# Altium schematic sheet 主控制芯片.SchDoc
size A3
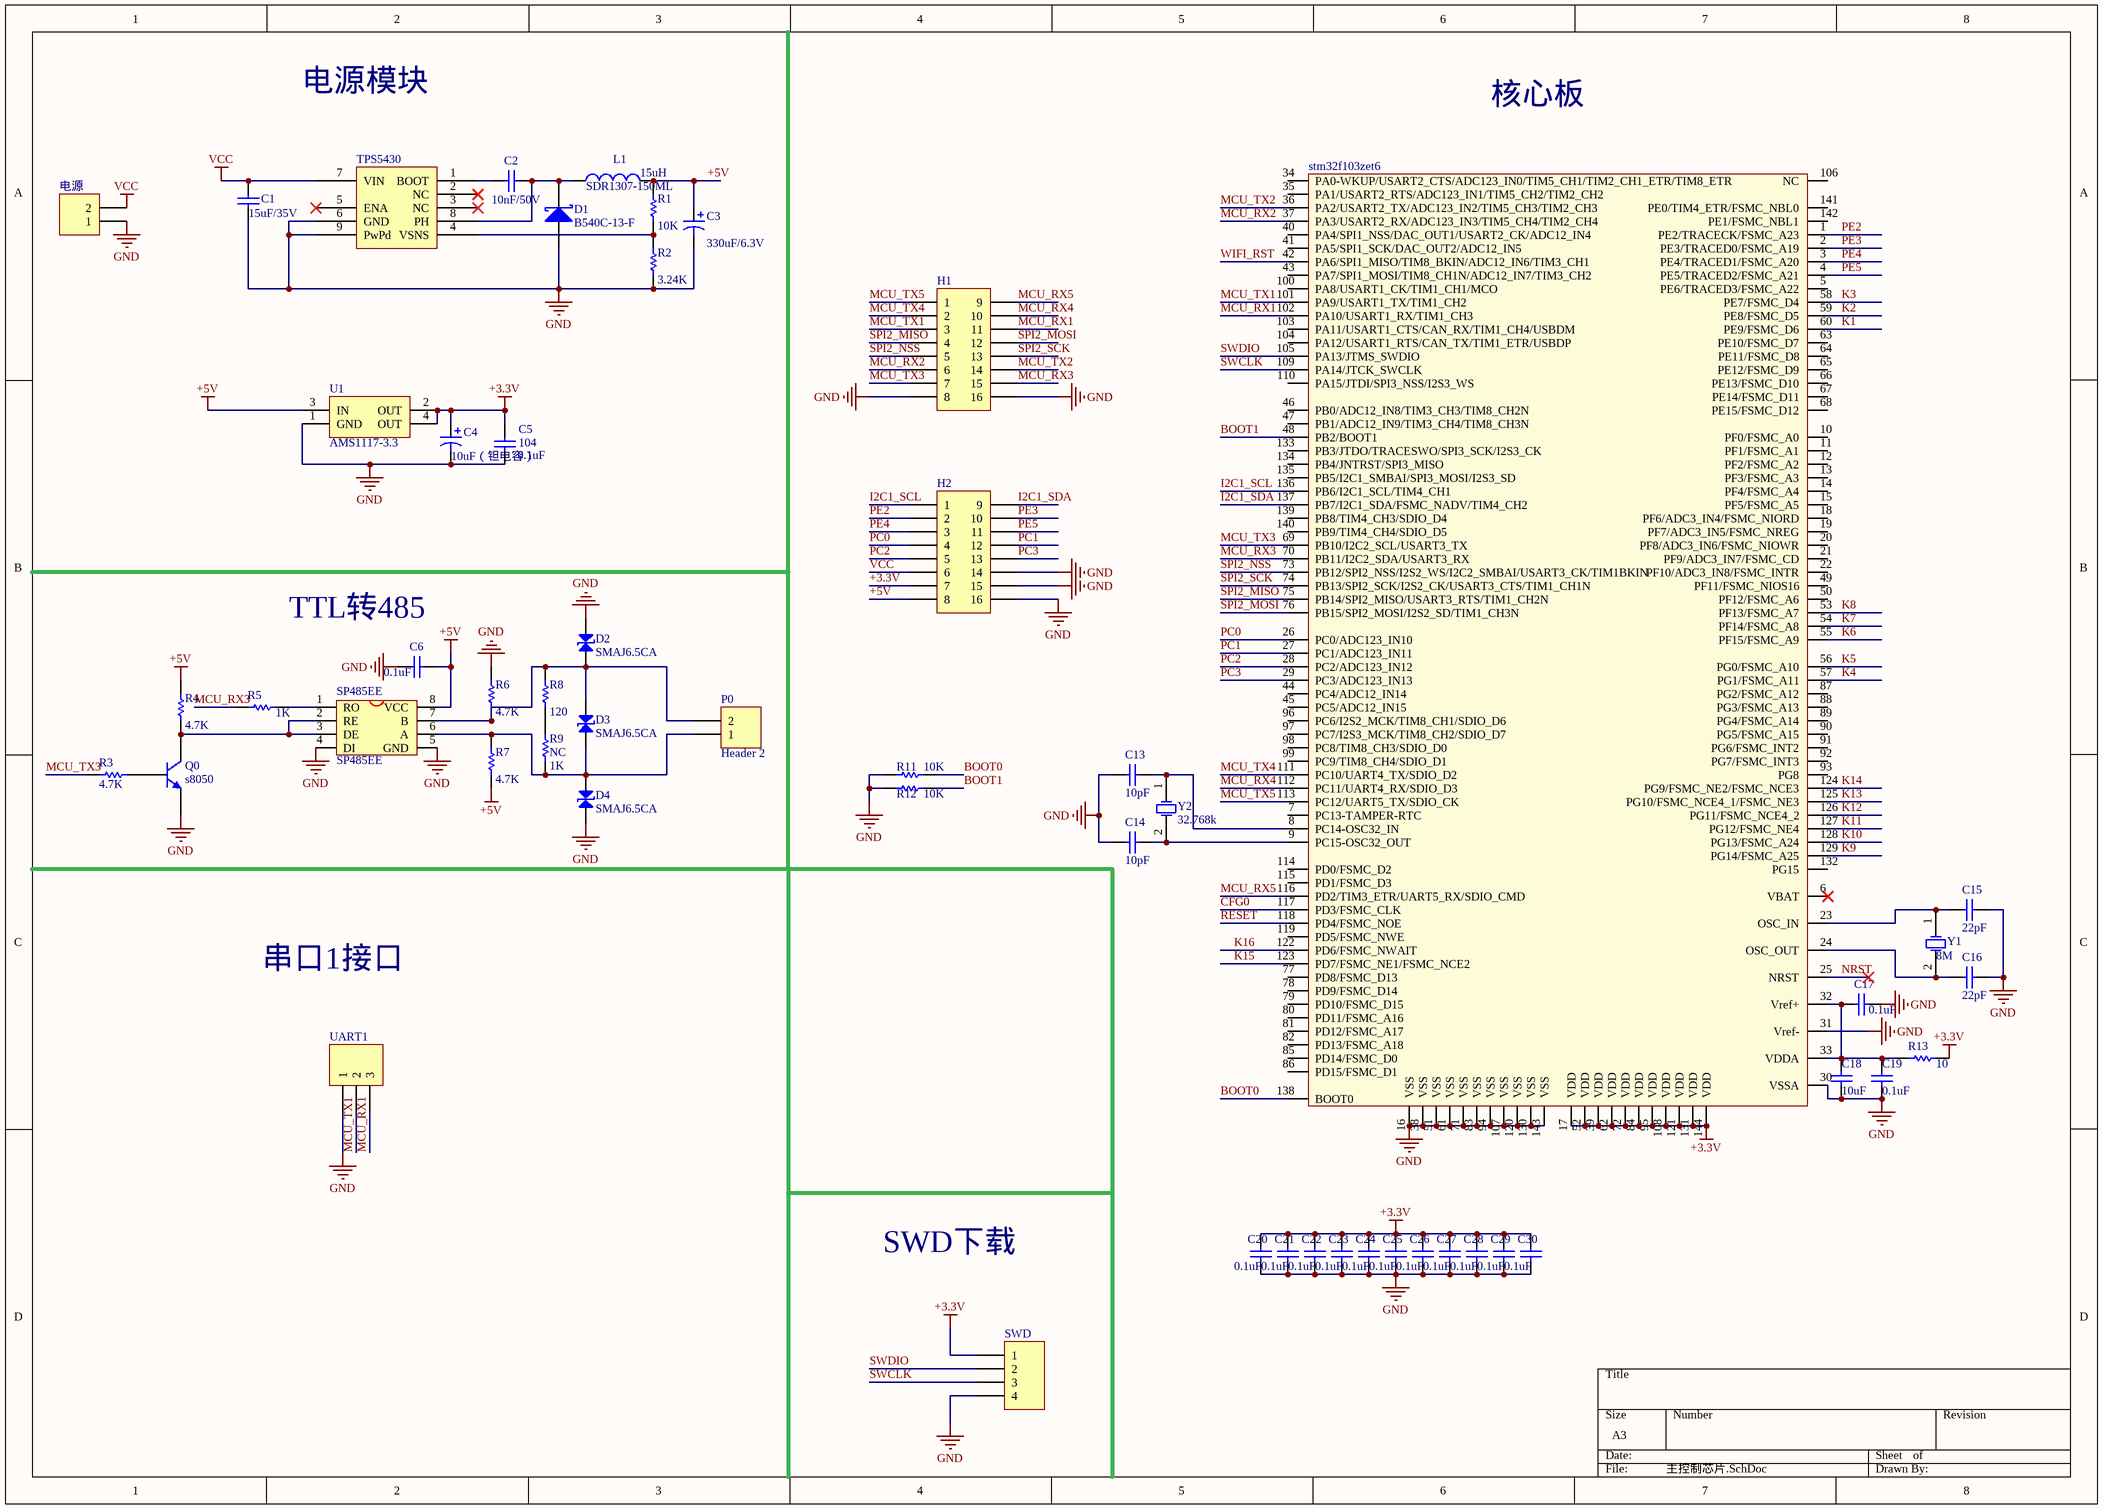
[diagram p0: 主控制芯片.SchDoc]

## Parts
C1  value 15uF/35V  [1206]  (hidden comment: C2012X5R1V156M125AC)
C2  value 10nF/50V  [0603]  (hidden comment: C0805C103K5RACTU)
C3  value 330uF/6.3V  [钽电容(D)]  (hidden comment: 6TPC330MA)
C4  10uF（钽电容）  [钽电容(B)]
C5  104  value 0.1uF  [0603]
C6  value 0.1uF  [0603]  (hidden comment: 104)
C13  value 10pF  [0603]  (hidden comment: 10)
C14  value 10pF  [0603]  (hidden comment: 10)
C15  value 22pF  [0603]  (hidden comment: 22)
C16  value 22pF  [0603]  (hidden comment: 22)
C17  value 0.1uF  [0603]  (hidden comment: 104)
C18  value 10uF  [0603]  (hidden comment: 106)
C19  value 0.1uF  [0603]  (hidden comment: 104)
C20  value 0.1uF  [0603]  (hidden comment: 104)
C21  value 0.1uF  [0603]  (hidden comment: 104)
C22  value 0.1uF  [0603]  (hidden comment: 104)
C23  value 0.1uF  [0603]  (hidden comment: 104)
C24  value 0.1uF  [0603]  (hidden comment: 104)
C25  value 0.1uF  [0603]  (hidden comment: 104)
C26  value 0.1uF  [0603]  (hidden comment: 104)
C27  value 0.1uF  [0603]  (hidden comment: 104)
C28  value 0.1uF  [0603]  (hidden comment: 104)
C29  value 0.1uF  [0603]  (hidden comment: 104)
C30  value 0.1uF  [0603]  (hidden comment: 104)
D1  B540C-13-F  [SMC]
D2  SMAJ6.5CA  [SMA]
D3  SMAJ6.5CA  [SMA]
D4  SMAJ6.5CA  [SMA]
H1  Header 8X2A  [HDR2X8_CEN]  (value not drawn)
H2  Header 8X2A  [HDR2X8_CEN]  (value not drawn)
L1  SDR1307-150ML  value 15uH  [CDRH127]
P0  Header 2  [电源]
Q0  s8050  [SOT-23]
R1  10K  [0603]
R2  3.24K  [0603]
R3  4.7k  [0603]
R4  4.7k  [0603]
R5  1K  [0603]
R6  4.7k  [0603]
R7  4.7k  [0603]
R8  120  [0603]
R9  NC  value 1K  [0603]
R11  10K  [0603]
R12  10K  [0603]
R13  10  [0603]
SP485EE  SP485EE  [SOP-8]
stm32f103zet6  stm32f103zet6  [LQFP144]  (value not drawn)
SWD  Header 4  [SWD]  (value not drawn)
TPS5430  TPS5430DDAR  [TPS5430]  (value not drawn)
U1  AMS1117-3.3  [1117-3.3]
UART1  Header 3  [H3]  (value not drawn)
Y1  8M  [5032(8M)]
Y2  32.768k  [FC135(32.768K)]
电源  DUANZI  [电源]  (value not drawn)

## Nets
+3.3V: C4.1 C5.2 C20.1 C21.1 C22.1 C23.1 C24.1 C25.1 C26.1 C27.1 C28.1 C29.1 C30.1 H2.7 R13.2 stm32f103zet6.17(VDD) stm32f103zet6.39(VDD) stm32f103zet6.52(VDD) stm32f103zet6.62(VDD) stm32f103zet6.72(VDD) stm32f103zet6.84(VDD) stm32f103zet6.95(VDD) stm32f103zet6.108(VDD) stm32f103zet6.121(VDD) stm32f103zet6.131(VDD) stm32f103zet6.144(VDD) SWD.1 U1.2(OUT) U1.4(OUT)
+5V: C3.1 C6.2 H2.8 L1.2 R1.2 R4.1 R7.2 SP485EE.8(VCC) U1.3(IN)
GND: C1.2 C3.2 C4.2 C5.1 C6.1 C13.2 C14.2 C15.1 C16.1 C17.1 C18.2 C19.2 C20.2 C21.2 C22.2 C23.2 C24.2 C25.2 C26.2 C27.2 C28.2 C29.2 C30.2 D1.1(A) D2.2 D4.1 H1.8 H1.16 H2.14 H2.15 H2.16 Q0.3(E) R2.1 R6.1 R11.2 R12.2 SP485EE.4(DI) SP485EE.5(GND) stm32f103zet6.16(VSS) stm32f103zet6.30(VSSA) stm32f103zet6.31(Vref-) stm32f103zet6.38(VSS) stm32f103zet6.51(VSS) stm32f103zet6.61(VSS) stm32f103zet6.71(VSS) stm32f103zet6.83(VSS) stm32f103zet6.94(VSS) stm32f103zet6.107(VSS) stm32f103zet6.120(VSS) stm32f103zet6.130(VSS) stm32f103zet6.143(VSS) SWD.4 TPS5430.6(GND) TPS5430.9(PwPd) U1.1(GND) UART1.1 电源.1
VCC: C1.1 H2.6 TPS5430.7(VIN) 电源.2
BOOT0: R11.1 stm32f103zet6.138(BOOT0)
BOOT1: R12.1 stm32f103zet6.48(PB2/BOOT1)
CFG0: stm32f103zet6.117(PD3/FSMC_CLK)
I2C1_SCL: H2.1 stm32f103zet6.136(PB6/I2C1_SCL/TIM4_CH1)
I2C1_SDA: H2.9 stm32f103zet6.137(PB7/I2C1_SDA/FSMC_NADV/TIM4_CH2)
K1: stm32f103zet6.60(PE9/FSMC_D6)
K2: stm32f103zet6.59(PE8/FSMC_D5)
K3: stm32f103zet6.58(PE7/FSMC_D4)
K4: stm32f103zet6.57(PG1/FSMC_A11)
K5: stm32f103zet6.56(PG0/FSMC_A10)
K6: stm32f103zet6.55(PF15/FSMC_A9)
K7: stm32f103zet6.54(PF14/FSMC_A8)
K8: stm32f103zet6.53(PF13/FSMC_A7)
K9: stm32f103zet6.129(PG14/FSMC_A25)
K10: stm32f103zet6.128(PG13/FSMC_A24)
K11: stm32f103zet6.127(PG12/FSMC_NE4)
K12: stm32f103zet6.126(PG11/FSMC_NCE4_2)
K13: stm32f103zet6.125(PG10/FSMC_NCE4_1/FSMC_NE3)
K14: stm32f103zet6.124(PG9/FSMC_NE2/FSMC_NCE3)
K15: stm32f103zet6.123(PD7/FSMC_NE1/FSMC_NCE2)
K16: stm32f103zet6.122(PD6/FSMC_NWAIT)
MCU_RX1: H1.11 stm32f103zet6.102(PA10/USART1_RX/TIM1_CH3) UART1.3
MCU_RX2: H1.6 stm32f103zet6.37(PA3/USART2_RX/ADC123_IN3/TIM5_CH4/TIM2_CH4)
MCU_RX3: H1.15 R5.1 stm32f103zet6.70(PB11/I2C2_SDA/USART3_RX)
MCU_RX4: H1.10 stm32f103zet6.112(PC11/UART4_RX/SDIO_D3)
MCU_RX5: H1.9 stm32f103zet6.116(PD2/TIM3_ETR/UART5_RX/SDIO_CMD)
MCU_TX1: H1.3 stm32f103zet6.101(PA9/USART1_TX/TIM1_CH2) UART1.2
MCU_TX2: H1.14 stm32f103zet6.36(PA2/USART2_TX/ADC123_IN2/TIM5_CH3/TIM2_CH3)
MCU_TX3: H1.7 R3.1 stm32f103zet6.69(PB10/I2C2_SCL/USART3_TX)
MCU_TX4: H1.2 stm32f103zet6.111(PC10/UART4_TX/SDIO_D2)
MCU_TX5: H1.1 stm32f103zet6.113(PC12/UART5_TX/SDIO_CK)
NRST: stm32f103zet6.25(NRST)
PC0: H2.4 stm32f103zet6.26(PC0/ADC123_IN10)
PC1: H2.12 stm32f103zet6.27(PC1/ADC123_IN11)
PC2: H2.5 stm32f103zet6.28(PC2/ADC123_IN12)
PC3: H2.13 stm32f103zet6.29(PC3/ADC123_IN13)
PE2: H2.2 stm32f103zet6.1(PE2/TRACECK/FSMC_A23)
PE3: H2.10 stm32f103zet6.2(PE3/TRACED0/FSMC_A19)
PE4: H2.3 stm32f103zet6.3(PE4/TRACED1/FSMC_A20)
PE5: H2.11 stm32f103zet6.4(PE5/TRACED2/FSMC_A21)
RESET: stm32f103zet6.118(PD4/FSMC_NOE)
SPI2_MISO: H1.4 stm32f103zet6.75(PB14/SPI2_MISO/USART3_RTS/TIM1_CH2N)
SPI2_MOSI: H1.12 stm32f103zet6.76(PB15/SPI2_MOSI/I2S2_SD/TIM1_CH3N)
SPI2_NSS: H1.5 stm32f103zet6.73(PB12/SPI2_NSS/I2S2_WS/I2C2_SMBAI/USART3_CK/TIM1BKIN)
SPI2_SCK: H1.13 stm32f103zet6.74(PB13/SPI2_SCK/I2S2_CK/USART3_CTS/TIM1_CH1N)
SWCLK: stm32f103zet6.109(PA14/JTCK_SWCLK) SWD.3
SWDIO: stm32f103zet6.105(PA13/JTMS_SWDIO) SWD.2
WIFI_RST: stm32f103zet6.42(PA6/SPI1_MISO/TIM8_BKIN/ADC12_IN6/TIM3_CH1)
NetC2_1: C2.1 TPS5430.1(BOOT)
NetC2_2: C2.2 D1.2(K) L1.1 TPS5430.8(PH)
NetC13_1: C13.1 stm32f103zet6.8(PC14-OSC32_IN) Y2.1(OSC1)
NetC14_1: C14.1 stm32f103zet6.9(PC15-OSC32_OUT) Y2.2(OSC2)
NetC15_2: C15.2 stm32f103zet6.23(OSC_IN) Y1.1(OSC1)
NetC16_2: C16.2 stm32f103zet6.24(OSC_OUT) Y1.2(OSC2)
NetC17_2: C17.2 C18.1 C19.1 R13.1 stm32f103zet6.32(Vref+) stm32f103zet6.33(VDDA)
NetD2_1: D2.1 D3.2 P0.2 R6.2 R8.2 SP485EE.7(B)
NetD3_1: D3.1 D4.2 P0.1 R7.1 R9.1 SP485EE.6(A)
NetQ0_1: Q0.1(C) R4.2 SP485EE.2(RE) SP485EE.3(DE)
NetQ0_2: Q0.2(B) R3.2
NetR1_1: R1.1 R2.2 TPS5430.4(VSNS)
NetR5_2: R5.2 SP485EE.1(RO)
NetR8_1: R8.1 R9.2

Not connected (* = marked no-connect by the designer): stm32f103zet6 5(PE6/TRACED3/FSMC_A22) 6(VBAT)* 7(PC13-TAMPER-RTC) 10(PF0/FSMC_A0) 11(PF1/FSMC_A1) 12(PF2/FSMC_A2) 13(PF3/FSMC_A3) 14(PF4/FSMC_A4) 15(PF5/FSMC_A5) 18(PF6/ADC3_IN4/FSMC_NIORD) 19(PF7/ADC3_IN5/FSMC_NREG) 20(PF8/ADC3_IN6/FSMC_NIOWR) 21(PF9/ADC3_IN7/FSMC_CD) 22(PF10/ADC3_IN8/FSMC_INTR) 34(PA0-WKUP/USART2_CTS/ADC123_IN0/TIM5_CH1/TIM2_CH1_ETR/TIM8_ETR) 35(PA1/USART2_RTS/ADC123_IN1/TIM5_CH2/TIM2_CH2) 40(PA4/SPI1_NSS/DAC_OUT1/USART2_CK/ADC12_IN4) 41(PA5/SPI1_SCK/DAC_OUT2/ADC12_IN5) 43(PA7/SPI1_MOSI/TIM8_CH1N/ADC12_IN7/TIM3_CH2) 44(PC4/ADC12_IN14) 45(PC5/ADC12_IN15) 46(PB0/ADC12_IN8/TIM3_CH3/TIM8_CH2N) 47(PB1/ADC12_IN9/TIM3_CH4/TIM8_CH3N) 49(PF11/FSMC_NIOS16) 50(PF12/FSMC_A6) 63(PE10/FSMC_D7) 64(PE11/FSMC_D8) 65(PE12/FSMC_D9) 66(PE13/FSMC_D10) 67(PE14/FSMC_D11) 68(PE15/FSMC_D12) 77(PD8/FSMC_D13) 78(PD9/FSMC_D14) 79(PD10/FSMC_D15) 80(PD11/FSMC_A16) 81(PD12/FSMC_A17) 82(PD13/FSMC_A18) 85(PD14/FSMC_D0) 86(PD15/FSMC_D1) 87(PG2/FSMC_A12) 88(PG3/FSMC_A13) 89(PG4/FSMC_A14) 90(PG5/FSMC_A15) 91(PG6/FSMC_INT2) 92(PG7/FSMC_INT3) 93(PG8) 96(PC6/I2S2_MCK/TIM8_CH1/SDIO_D6) 97(PC7/I2S3_MCK/TIM8_CH2/SDIO_D7) 98(PC8/TIM8_CH3/SDIO_D0) 99(PC9/TIM8_CH4/SDIO_D1) 100(PA8/USART1_CK/TIM1_CH1/MCO) 103(PA11/USART1_CTS/CAN_RX/TIM1_CH4/USBDM) 104(PA12/USART1_RTS/CAN_TX/TIM1_ETR/USBDP) 106(NC) 110(PA15/JTDI/SPI3_NSS/I2S3_WS) 114(PD0/FSMC_D2) 115(PD1/FSMC_D3) 119(PD5/FSMC_NWE) 132(PG15) 133(PB3/JTDO/TRACESWO/SPI3_SCK/I2S3_CK) 134(PB4/JNTRST/SPI3_MISO) 135(PB5/I2C1_SMBAI/SPI3_MOSI/I2S3_SD) 139(PB8/TIM4_CH3/SDIO_D4) 140(PB9/TIM4_CH4/SDIO_D5) 141(PE0/TIM4_ETR/FSMC_NBL0) 142(PE1/FSMC_NBL1); TPS5430 2(NC)* 3(NC)* 5(ENA)*

## Notes on the sheet
- 电源模块
- 核心板
- (near C6) TTL转485
- 串口1接口
- SWD下载

## Library data of the parts
C1 C2 C5 C6 C13-C30 = Cap: Capacitor; Published: 8-Jun-2000; LatestRevisionDate: 17-Jul-2002; LatestRevisionNote: Re-released for DXP Platform.; PackageReference: RAD-0.3; Publisher: Altium Limited
  C1 C2 C6 C17-C19: PackageDescription: Radial Cap, Thru-Hole; 2 Leads; 0.3 in Pin Spacing
C3 = Cap Pol1: Polarized Capacitor (Radial); Published: 8-Jun-2000; LatestRevisionDate: 17-Jul-2002; LatestRevisionNote: Re-released for DXP Platform.; PackageReference: RB7.6-15; Publisher: Altium Limited; PackageDescription: Polarized Capacitor (Radial); 2 Leads
C4 = Cap Pol1: Polarized Capacitor (Radial); Value: 10uF; Published: 8-Jun-2000; LatestRevisionDate: 17-Jul-2002; LatestRevisionNote: Re-released for DXP Platform.; PackageReference: RB7.6-15; Publisher: Altium Limited
D1 = D Schottky: Schottky Diode; Published: 8-Jun-2000; LatestRevisionDate: 17-Jul-2002; LatestRevisionNote: Re-released for DXP Platform.; PackageReference: SMB; Publisher: Altium Limited; PackageDescription: DO-214-AA/SMB; 2 C-Bend Leads; Body 5.3 x 3.6 mm, inc. leads (LxW); Code_JEDEC: DO-214-AA
D2-D4 = MSCJ6.5CA
H1 H2 = Header 8X2A: Header, 8-Pin, Dual row; LatestRevisionDate: 17-Jul-2002; LatestRevisionNote: Re-released for DXP Platform.; Publisher: Altium Limited
L1 = Inductor: Code_IEC: 1005; Published: 8-Jun-2000; LatestRevisionDate: 29-May-2009; LatestRevisionNote: IPC-7351 Footprint Added.; PackageReference: 0402-A; Publisher: Altium Limited; PackageDescription: Chip Inductor; Code_JEITA: 0402
P0 电源 = Header 2: Header, 2-Pin; LatestRevisionDate: 17-Jul-2002; LatestRevisionNote: Re-released for DXP Platform.; Publisher: Altium Limited
Q0 = NPN: NPN Bipolar Transistor; Published: 8-Jun-2000; LatestRevisionDate: 17-Jul-2002; LatestRevisionNote: Re-released for DXP Platform.; PackageReference: TO-226-AA; Publisher: Altium Limited; PackageDescription: TO, Flat Index; 3 In-Line, Axial Leads; Body Dia. 4.8mm; Leads 0.55 x 0.51 mm (max); Code_JEDEC: TO-226-AA
R1-R9 R11-R13 = Res1: Resistor; Published: 8-Jun-2000; LatestRevisionDate: 17-Jul-2002; LatestRevisionNote: Re-released for DXP Platform.; PackageReference: AXIAL-0.3; Publisher: Altium Limited; PackageDescription: Axial Device, Thru-Hole; 2 Leads; 0.3 in Pin Spacing
  R1 R11 R12: Value: 10K
  R2: Value: 3.24K
  R3 R4 R6 R7: Value: 4.7K
  R5: Value: 1K
  R8: Value: 120
  R13: Value: 10
SWD = Header 4: Header, 4-Pin; LatestRevisionDate: 17-Jul-2002; LatestRevisionNote: Re-released for DXP Platform.; Publisher: Altium Limited
TPS5430 = TPS5430
U1 = REG1117-3.3: 800mA and 1A Low Dropout Positive Regulator 2.85V, 3.3V, 5V, and Adjustable; Published: 8-Jun-2000; LatestRevisionDate: 17-Jul-2002; LatestRevisionNote: Re-released for DXP Platform.; DatasheetVersion: Sep-1997; PackageVersion: revC; PackageReference: ZZ311; Publisher: Altium Limited; PackageDescription: SOT-223/SC-73; 4 Leads; Body 6.7 x 7.3 mm, inc. leads (LxW max); ComponentLink1Description: Manufacturer Link; ComponentLink1URL: http://www.ti.com/; ComponentLink2Description: Datasheet; ComponentLink2URL: http://www-s.ti.com/sc/ds/REG1117.pdf
UART1 = Header 3: Header, 3-Pin; LatestRevisionDate: 17-Jul-2002; LatestRevisionNote: Re-released for DXP Platform.; Publisher: Altium Limited
Y1 Y2 = XTAL: Crystal Oscillator; Published: 8-Jun-2000; LatestRevisionDate: 17-Jul-2002; LatestRevisionNote: Re-released for DXP Platform.; PackageReference: R38; Publisher: Altium Limited